# Altium schematic sheet sensors.SchDoc: Sensors Module
size A3; Author: Pietro Lorefice; Address3: Firenze; Address4: ITALY; Revision: 0; SheetNumber: 2; SheetTotal: 2; License: GPLv3
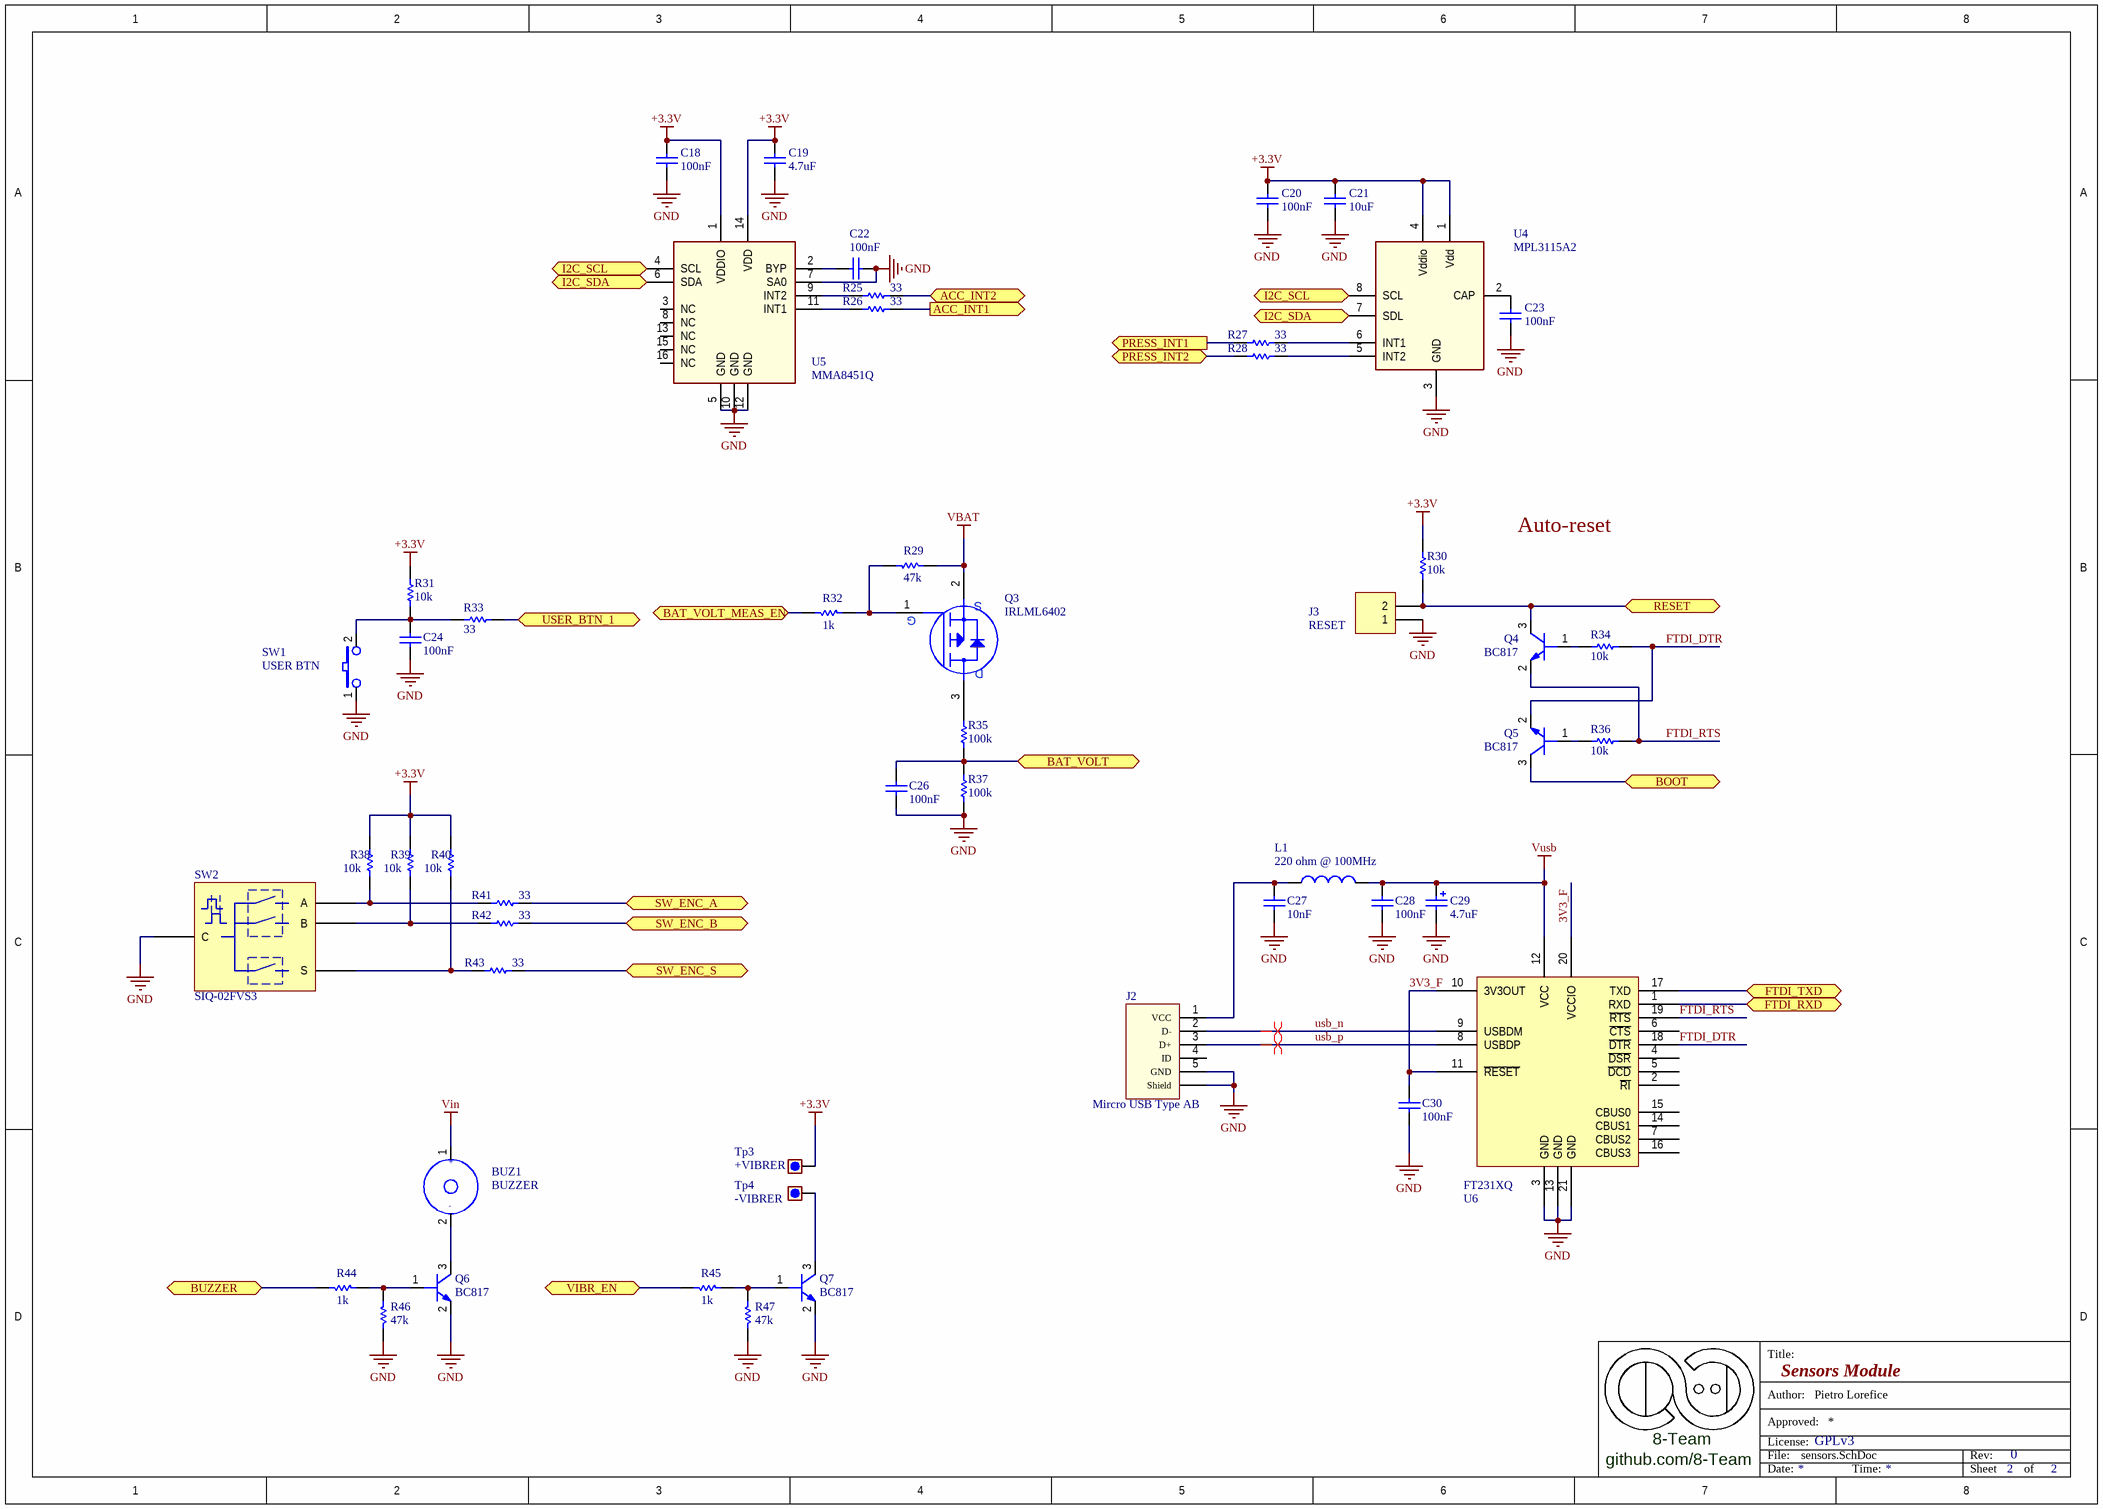
[diagram p0: sensors.SchDoc]

## Parts
BUZ1  BUZZER  [BUZZER_9x9MM_SMD]
C18  100nF  [0402_[1005]]
C19  4.7uF  [0603_[1608]]
C20  100nF  [0402_[1005]]
C21  10uF  [0603_[1608]]
C22  100nF  [0402_[1005]]
C23  100nF  [0402_[1005]]
C24  100nF  [0402_[1005]]
C26  100nF  [0402_[1005]]
C27  10nF  [0402_[1005]]
C28  100nF  [0402_[1005]]
C29  4.7uF  [0603_[1608]]
C30  100nF  [0402_[1005]]
J2  Mircro USB Type AB  [USB_MIRCO_AB_SMD]
J3  RESET  [0603_[1608]]
L1  220 ohm @ 100MHz  [0805_[2012]]
Q3  IRLML6402  [SOT-23]
Q4  BC817  [SOT-23]
Q5  BC817  [SOT-23]
Q6  BC817  [SOT-23]
Q7  BC817  [SOT-23]
R25  33  [0402_[1005]]
R26  33  [0402_[1005]]
R27  33  [0402_[1005]]
R28  33  [0402_[1005]]
R29  47k  [0402_[1005]]
R30  10k  [0402_[1005]]
R31  10k  [0402_[1005]]
R32  1k  [0402_[1005]]
R33  33  [0402_[1005]]
R34  10k  [0402_[1005]]
R35  100k  [0402_[1005]]
R36  10k  [0402_[1005]]
R37  100k  [0402_[1005]]
R38  10k  [0402_[1005]]
R39  10k  [0402_[1005]]
R40  10k  [0402_[1005]]
R41  33  [0402_[1005]]
R42  33  [0402_[1005]]
R43  33  [0402_[1005]]
R44  1k  [0402_[1005]]
R45  1k  [0402_[1005]]
R46  47k  [0402_[1005]]
R47  47k  [0402_[1005]]
SW1  USER BTN  [TACTILE_SWITCH_6x3.8MM_SMD]
SW2  SIQ-02FVS3  [SIQ-02FVS3]
Tp3  +VIBRER  [TEST_POINT_SMD_D1.6MM]  (no BOM)
Tp4  -VIBRER  [TEST_POINT_SMD_D1.6MM]  (no BOM)
U4  MPL3115A2  [LGA_SENSOR_3x5x1.25MM]
U5  MMA8451Q  [QFN50P300X300X100-16L]
U6  FT231XQ  [QFN50P400X400X80_HS-21L]

## Ports
ACC_INT1 (out), ACC_INT2 (bidir), BAT_VOLT (bidir), BAT_VOLT_MEAS_EN (bidir), BOOT (bidir), BUZZER (bidir), FTDI_RXD (bidir), FTDI_TXD (bidir), I2C_SCL (out), I2C_SDA (bidir), PRESS_INT1 (out), PRESS_INT2 (bidir), RESET (bidir), SW_ENC_A (bidir), SW_ENC_B (bidir), SW_ENC_S (bidir), USER_BTN_1 (bidir), VIBR_EN (bidir)

## Nets
+3.3V: C18.2 C19.2 C20.2 C21.2 R30.2 R31.2 R38.2 R39.2 R40.2 Tp3.1 U4.1(Vdd) U4.4(Vddio) U5.1(VDDIO) U5.14(VDD)
GND: C18.1 C19.1 C20.1 C21.1 C22.1 C23.1 C24.1 C26.1 C27.1 C28.1 C29.2 C30.1 J2.5(GND) J2.Shell(Shield) J3.1 Q6.2(E) Q7.2(E) R37.1 R46.2 R47.2 SW1.1 SW2.4(C) U4.3(GND) U5.5(GND) U5.7(SA0) U5.10(GND) U5.12(GND) U6.3(GND) U6.13(GND) U6.21(GND)
VBAT: Q3.2(S) R29.1
Vin: BUZ1.1
Vusb: C28.2 C29.1 L1.2 U6.12(VCC)
3V3_F: C30.2 U6.10(3V3OUT) U6.11(~{RESET}) U6.20(VCCIO)
ACC_INT1: R26.2 ; port ACC_INT1
ACC_INT2: R25.2 ; port ACC_INT2
BAT_VOLT: C26.2 R35.1 R37.2 ; port BAT_VOLT
BAT_VOLT_MEAS_EN: R32.2 ; port BAT_VOLT_MEAS_EN
BOOT: Q5.3(C) ; port BOOT
BUZZER: R44.2 ; port BUZZER
FTDI_DTR: Q5.2(E) R34.1 U6.18(~{DTR})
FTDI_RTS: Q4.2(E) R36.1 U6.19(~{RTS})
FTDI_RXD: U6.1(RXD) ; port FTDI_RXD
FTDI_TXD: U6.17(TXD) ; port FTDI_TXD
I2C_SCL: U4.8(SCL) U5.4(SCL) ; port I2C_SCL
I2C_SDA: U4.7(SDL) U5.6(SDA) ; port I2C_SDA
PRESS_INT1: R27.1 ; port PRESS_INT1
PRESS_INT2: R28.1 ; port PRESS_INT2
RESET: J3.2 Q4.3(C) R30.1 ; port RESET
SW_ENC_A: R41.2 ; port SW_ENC_A
SW_ENC_B: R42.2 ; port SW_ENC_B
SW_ENC_S: R43.2 ; port SW_ENC_S
usb_n: J2.2(D-) U6.9(USBDM)
usb_p: J2.3(D+) U6.8(USBDP)
USER_BTN_1: R33.2 ; port USER_BTN_1
VIBR_EN: R45.2 ; port VIBR_EN
NetBUZ1_2: BUZ1.2 Q6.3(C)
NetC22_2: C22.2 U5.2(BYP)
NetC23_2: C23.2 U4.2(CAP)
NetC24_2: C24.2 R31.1 R33.1 SW1.2
NetC27_2: C27.2 J2.1(VCC) L1.1
NetQ3_1: Q3.1(G) R29.2 R32.1
NetQ3_3: Q3.3(D) R35.2
NetQ4_1: Q4.1(B) R34.2
NetQ5_1: Q5.1(B) R36.2
NetQ6_1: Q6.1(B) R44.1 R46.1
NetQ7_1: Q7.1(B) R45.1 R47.1
NetQ7_3: Q7.3(C) Tp4.1
NetR25_1: R25.1 U5.9(INT2)
NetR26_1: R26.1 U5.11(INT1)
NetR27_2: R27.2 U4.6(INT1)
NetR28_2: R28.2 U4.5(INT2)
NetR38_1: R38.1 R41.1 SW2.1(A)
NetR39_1: R39.1 R42.1 SW2.2(B)
NetR40_1: R40.1 R43.1 SW2.3(S)

Not connected (* = marked no-connect by the designer): J2 4(ID); SW1 3(GND) 4(GND); U5 3(NC) 8(NC) 13(NC) 15(NC) 16(NC); U6 2(~{RI}) 4(~{DSR}) 5(~{DCD}) 6(~{CTS}) 7(CBUS2) 14(CBUS1) 15(CBUS0) 16(CBUS3)

## Layout directives
differential pair: usb_n, usb_p

## Notes on the sheet
- Auto-reset
- Title:
- Author:
- 8-Team
- File:
- License:
- Approved:
- Rev:
- github.com/8-Team
- Date:
- Time:
- Sheet
- of
- (in symbol BUZZER) +; -

## Library data of the parts
C18-C23 = Cap: X7R 10%; Value: 10nF; Published: 8-Jun-2000; Revision: July-2002: Re-released for DXP Platform.; Publisher: Altium Limited
C24 C26-C28 C30 = Cap: Capacitor; Value: 0.1uF; Published: 8-Jun-2000; LatestRevisionDate: 17-Jul-2002; LatestRevisionNote: Re-released for DXP Platform.; PackageReference: RAD-0.3; Publisher: Altium Limited; PackageDescription: Radial Cap, Thru-Hole; 2 Leads; 0.3 in Pin Spacing
C29 = Cap Pol1: Polarized Capacitor (Radial); Value: 10uF; Published: 8-Jun-2000; Revision: July-2002: Re-released for DXP Platform.; Publisher: Altium Limited
J2 = USB_MICRO_TypeAB: Micro USB 2.0 Type AB Horizontal WR-COM; Part Number: 629105150921; Interface Type: Type AB; Gender: Receptacle; ComponentLink1Description: Manufacturer; ComponentLink1URL: http://www.we-online.de; ComponentLink2Description: Datasheet; ComponentLink2URL: http://katalog.we-online.de/em/datasheet/629105150921.pdf; Published Date: April 2017; Publisher: Wurth Elektronik; Sub-Family: Micro USB 2.0; Type: Horizontal; Construction: SMT
J3 = Header 2: Header, 2-Pin; LatestRevisionDate: 17-Jul-2002; LatestRevisionNote: Re-released for DXP Platform.; Publisher: Altium Limited
L1 = Inductor
Q3 = MOSFET-P 3pin
Q4-Q7 = BC817: BJT NPN
R25-R28 R33 R41-R43 = Res1: Resistor; Value: NC; Published: 8-Jun-2000; LatestRevisionDate: 17-Jul-2002; LatestRevisionNote: Re-released for DXP Platform.; PackageReference: AXIAL-0.3; Publisher: Altium Limited; PackageDescription: Axial Device, Thru-Hole; 2 Leads; 0.3 in Pin Spacing
R29 R46 R47 = Res1: Resistor; Value: 1K; Published: 8-Jun-2000; Revision: July-2002: Re-released for DXP Platform.; Publisher: Altium Limited
R30-R32 R34 R36 R38-R40 R44 R45 = Res1: Resistor; Published: 8-Jun-2000; Publisher: Altium Limited
  R30 R31 R34 R36 R38-R40: LatestRevisionDate: 17-Jul-2002; LatestRevisionNote: Re-released for DXP Platform.; PackageReference: AXIAL-0.3; PackageDescription: Axial Device, Thru-Hole; 2 Leads; 0.3 in Pin Spacing; Value: 10K
  R32 R44 R45: Revision: July-2002: Re-released for DXP Platform.; Value: 1K
R35 R37 = Res1: Resistor; Value: 10K; Published: 8-Jun-2000; LatestRevisionDate: 17-Jul-2002; LatestRevisionNote: Re-released for DXP Platform.; PackageReference: AXIAL-0.3; Publisher: Altium Limited; PackageDescription: Axial Device, Thru-Hole; 2 Leads; 0.3 in Pin Spacing
SW1 = SWITCH-RA: TACTILE Switch, 6x3.8mm, 2p (WE 434111025826); Part Number: Tyco FSMRA2JH; Purchase Code: RS 479-1520
SW2 = Rotary Encoder Switch: Slide and Rotary Encoder Switches
Tp3 Tp4 = Test_point
U4 = MPL3115A2: Precision pressure sensor with altimetry
U5 = MMA8451: 3-Axis,  14-bit/8-bit Digital Accelerometer
U6 = FT231X: USB to FULL HANDSHAKE UART IC